# Altium schematic sheet Main.SchDoc
size 152 x 63 mm
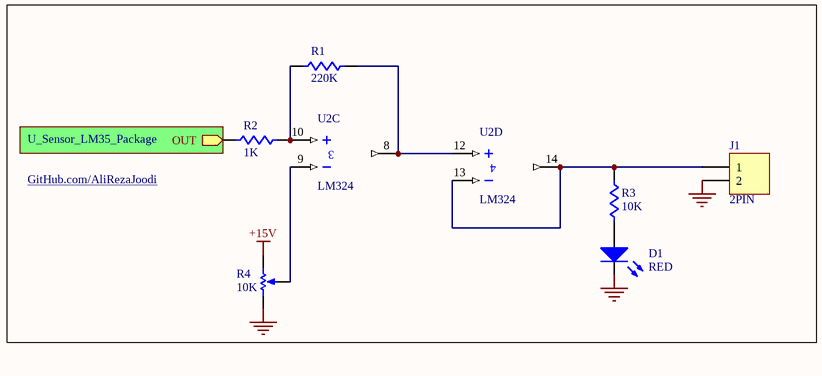
[diagram p0: Main.SchDoc]

## Parts
D1  RED  [LED-5mm_Red]
J1  2PIN  [Fonics_2PIN_1]
R1  220K  [AXIAL-0.4]
R2  1K  [AXIAL-0.4]
R3  10K  [AXIAL-0.4]
R4  10K  [VR4_]
U2  LM324  [646-06]  (parts C,D of 5)

## Sub-sheets
U_Sensor_LM35_Package = Sensor_LM35_Package.SchDoc: OUT (out)

## Nets
+15V: R4.2(BOT)
GND: D1.2(K) J1.2 R4.1(TOP)
NetD1_1: D1.1(A) R3.2
NetJ1_1: J1.1 R3.1 U2.13(IN-) U2.14(OUT)
NetR1_1: R1.1 R2.2 U2.10(IN+)
NetR1_2: R1.2 U2.8(OUT) U2.12(IN+)
NetR2_1: R2.1 ; sheet U_Sensor_LM35_Package/OUT
NetR4_3: R4.3(TAP) U2.9(IN-)

## Notes on the sheet
- GitHub.com/AliRezaJoodi

## Library data of the parts
D1 = LED: Typical INFRARED GaAs LED; Manufacturer: Generic Components; Class I: Optoelectronic; Published: 8-Jun-2000; Revision: July-2002: Re-released for DXP Platform.; Publisher: Altium Limited; Class II: LED
J1 = Header 2: Header, 2-Pin; Manufacturer: Generic Components; Class I: Connector; Revision: July-2002: Re-released for DXP Platform.; Publisher: Altium Limited
R1-R3 = Res1: Resistor; Manufacturer: Generic Components; Class I: Passive; Published: 8-Jun-2000; Revision: July-2002: Re-released for DXP Platform.; Publisher: Altium Limited; Class II: Resistor
R4 = RPot1: Potentiometer; Manufacturer: Generic Components; Class I: Passive; Set Position: 0.5; Published: 8-Jun-2000; Revision: July-2002: Re-released for DXP Platform.; Publisher: Altium Limited; Class II: Potentiometer
U2 = LM324: Quad Low-Power Operational Amplifier; Published: 17-Jul-2002; LatestRevisionDate: 06-Jun-2005; LatestRevisionNote: Stylized 3D Model Added.; DatasheetVersion: 1988; PackageVersion: 1997; PackageReference: 646-06; Publisher: Altium Limited; PackageDescription: DIP; 14 Leads; Row Spacing 7.62 mm; Pitch 2.54 mm; ComponentLink1Description: Manufacturer Link; ComponentLink1URL: http://www.onsemi.com/site/products/parametrics/0,4446,251,00.html; ComponentLink2Description: Datasheet; ComponentLink2URL: http://www.onsemi.com/pub/Collateral/LM324-D.PDF